# Altium schematic sheet 2N3904_SWITCH_LVTTL.SchDoc
size A4
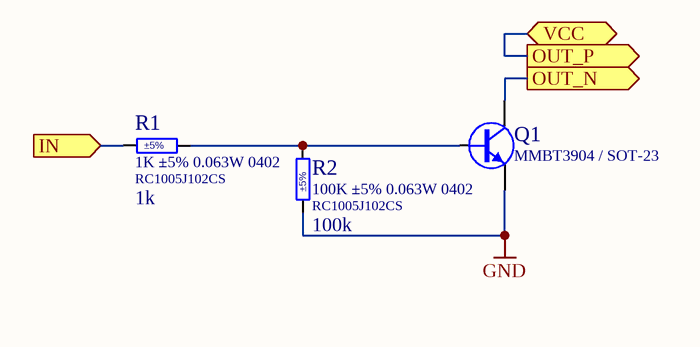
[diagram p0: 2N3904_SWITCH_LVTTL.SchDoc]

## Parts
Q1  MMBT3904 / SOT-23  [SOT-23]
R1  1K ±5% 0.063W 0402  value 1k  Name: RC1005J102CS  [0402]
R2  100K ±5% 0.063W 0402  value 100k  Name: RC1005J102CS  [0402]

## Ports
IN (in), OUT_N (out), OUT_P (out), VCC

## Nets
GND: Q1.2(E) R2.1
IN: R1.1 ; port IN
OUT_N: Q1.3(C) ; port OUT_N
OUT_P: port OUT_P, port VCC
NetQ1_1: Q1.1(B) R1.2 R2.2

## Library data of the parts
Q1 = MMBT3904: General Purpose Transistor; HelpURL: http://www.onsemi.ru.com/PowerSolutions/document/MMBT3904LT1-D.PDF; Name: MMBT3904; Manufacturer: *; BOMString: =Name+' / '+Footprint; Supplier: *
R1 R2 = Resistor: Thin Film Chip Resistor; Manufacturer: Samsung; Power: 0.063W; Tolerance: ±5%; Supplier: *; HelpURL: *; BOMString: =Resistance+' '+Tolerance+' '+Power+' '+Footprint
  R1: Resistance: 1K
  R2: Resistance: 100K